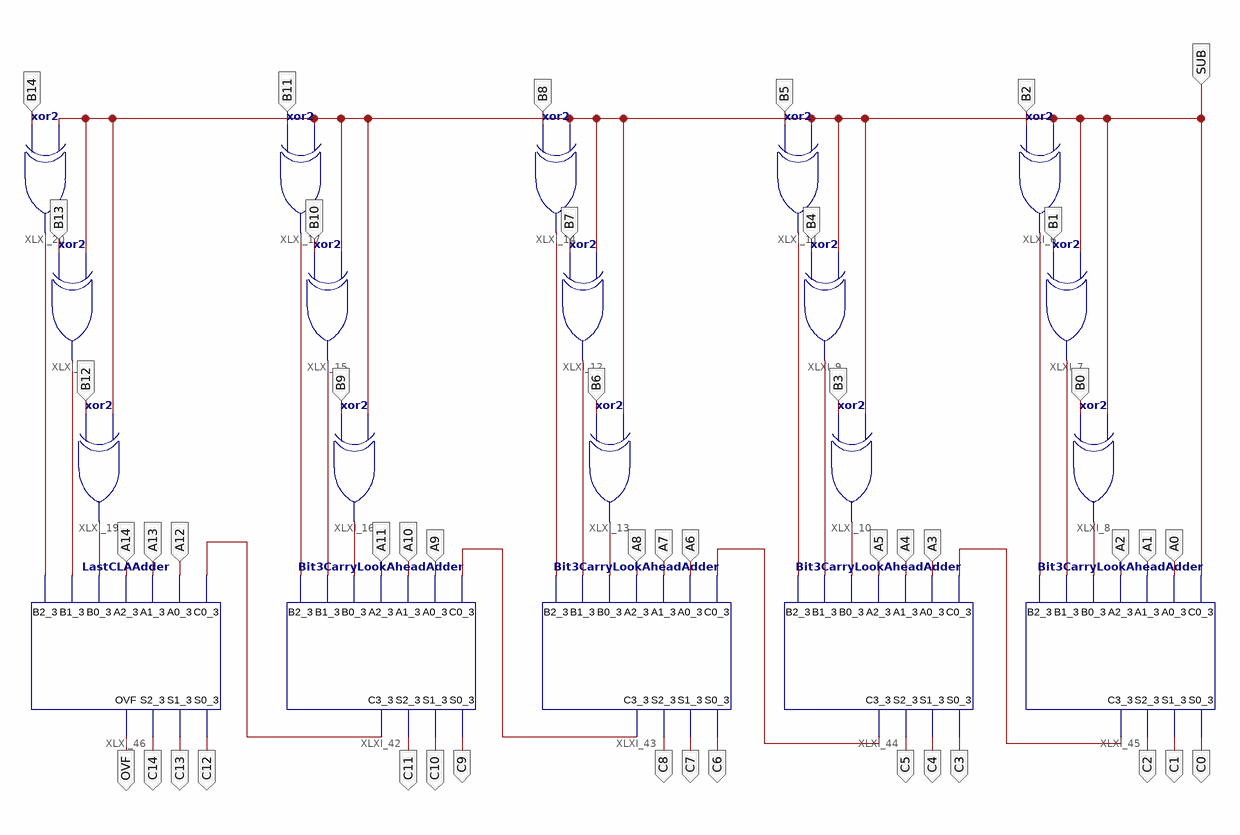
[diagram p0: schematic sheet 1]
// Xilinx ISE schematic Bit15CLAAdderSubtractor.sch (spartan3e) as structural Verilog: 20 symbols, 47 ports
module Bit15CLAAdderSubtractor (
  input  SUB,
  input  A0,
  input  A1,
  input  A2,
  input  B0,
  input  B1,
  input  B2,
  input  A3,
  input  A4,
  input  A5,
  input  B3,
  input  B4,
  input  B7,
  input  B6,
  input  A8,
  input  A7,
  input  A6,
  input  A9,
  input  A10,
  input  A11,
  input  A14,
  input  A13,
  input  A12,
  input  B9,
  input  B10,
  input  B12,
  input  B13,
  input  B14,
  input  B11,
  input  B8,
  input  B5,
  output C11,
  output C10,
  output C9,
  output C8,
  output C7,
  output C6,
  output C5,
  output C4,
  output C3,
  output C2,
  output C1,
  output C0,
  output OVF,
  output C14,
  output C13,
  output C12
);

  wire XLXN_1, XLXN_2, XLXN_3, XLXN_4, XLXN_6, XLXN_7, XLXN_8, XLXN_9, XLXN_10, XLXN_11, XLXN_12, XLXN_13,
       XLXN_14, XLXN_15, XLXN_16, XLXN_17, XLXN_18, XLXN_19, XLXN_20;

  xor XLXI_7 (XLXN_7, B1, SUB);
  xor XLXI_8 (XLXN_6, B0, SUB);
  xor XLXI_6 (XLXN_8, B2, SUB);
  xor XLXI_9 (XLXN_10, B4, SUB);
  xor XLXI_10 (XLXN_9, B3, SUB);
  xor XLXI_11 (XLXN_11, B5, SUB);
  xor XLXI_12 (XLXN_13, B7, SUB);
  xor XLXI_13 (XLXN_12, B6, SUB);
  xor XLXI_14 (XLXN_14, B8, SUB);
  xor XLXI_15 (XLXN_16, B10, SUB);
  xor XLXI_16 (XLXN_15, B9, SUB);
  xor XLXI_17 (XLXN_17, B11, SUB);
  xor XLXI_18 (XLXN_19, B13, SUB);
  xor XLXI_19 (XLXN_18, B12, SUB);
  xor XLXI_20 (XLXN_20, B14, SUB);
  Bit3CarryLookAheadAdder XLXI_42 (
    .A0_3(A9), .A1_3(A10), .A2_3(A11), .B0_3(XLXN_15), .B1_3(XLXN_16), .B2_3(XLXN_17), .C0_3(XLXN_2),
    .C3_3(XLXN_1), .S0_3(C9), .S1_3(C10), .S2_3(C11));
  Bit3CarryLookAheadAdder XLXI_43 (
    .A0_3(A6), .A1_3(A7), .A2_3(A8), .B0_3(XLXN_12), .B1_3(XLXN_13), .B2_3(XLXN_14), .C0_3(XLXN_3),
    .C3_3(XLXN_2), .S0_3(C6), .S1_3(C7), .S2_3(C8));
  Bit3CarryLookAheadAdder XLXI_44 (
    .A0_3(A3), .A1_3(A4), .A2_3(A5), .B0_3(XLXN_9), .B1_3(XLXN_10), .B2_3(XLXN_11), .C0_3(XLXN_4),
    .C3_3(XLXN_3), .S0_3(C3), .S1_3(C4), .S2_3(C5));
  Bit3CarryLookAheadAdder XLXI_45 (
    .A0_3(A0), .A1_3(A1), .A2_3(A2), .B0_3(XLXN_6), .B1_3(XLXN_7), .B2_3(XLXN_8), .C0_3(SUB), .C3_3(XLXN_4),
    .S0_3(C0), .S1_3(C1), .S2_3(C2));
  LastCLAAdder XLXI_46 (
    .A0_3(A12), .A1_3(A13), .A2_3(A14), .B0_3(XLXN_18), .B1_3(XLXN_19), .B2_3(XLXN_20), .C0_3(XLXN_1),
    .OVF(OVF), .S0_3(C12), .S1_3(C13), .S2_3(C14));
endmodule
